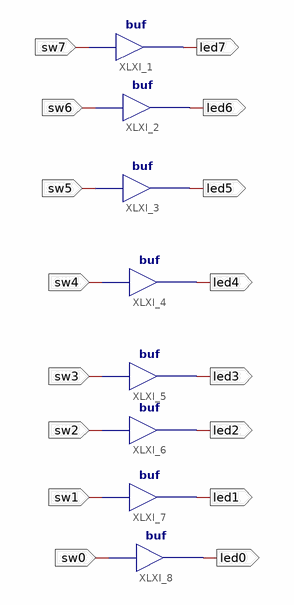
[diagram p0: schematic sheet 1]
// Xilinx ISE schematic ECE281_CPX1_Celiano_Top.sch (spartan3e) as structural Verilog: 8 symbols, 16 ports
module ECE281_CPX1_Celiano_Top (
  input  sw7,
  input  sw6,
  input  sw5,
  input  sw4,
  input  sw3,
  input  sw2,
  input  sw1,
  input  sw0,
  output led7,
  output led6,
  output led5,
  output led4,
  output led3,
  output led2,
  output led1,
  output led0
);

  buf XLXI_1 (led7, sw7);
  buf XLXI_2 (led6, sw6);
  buf XLXI_3 (led5, sw5);
  buf XLXI_4 (led4, sw4);
  buf XLXI_5 (led3, sw3);
  buf XLXI_6 (led2, sw2);
  buf XLXI_7 (led1, sw1);
  buf XLXI_8 (led0, sw0);
endmodule
